# Altium schematic sheet ANSIN.SchDoc
size A3
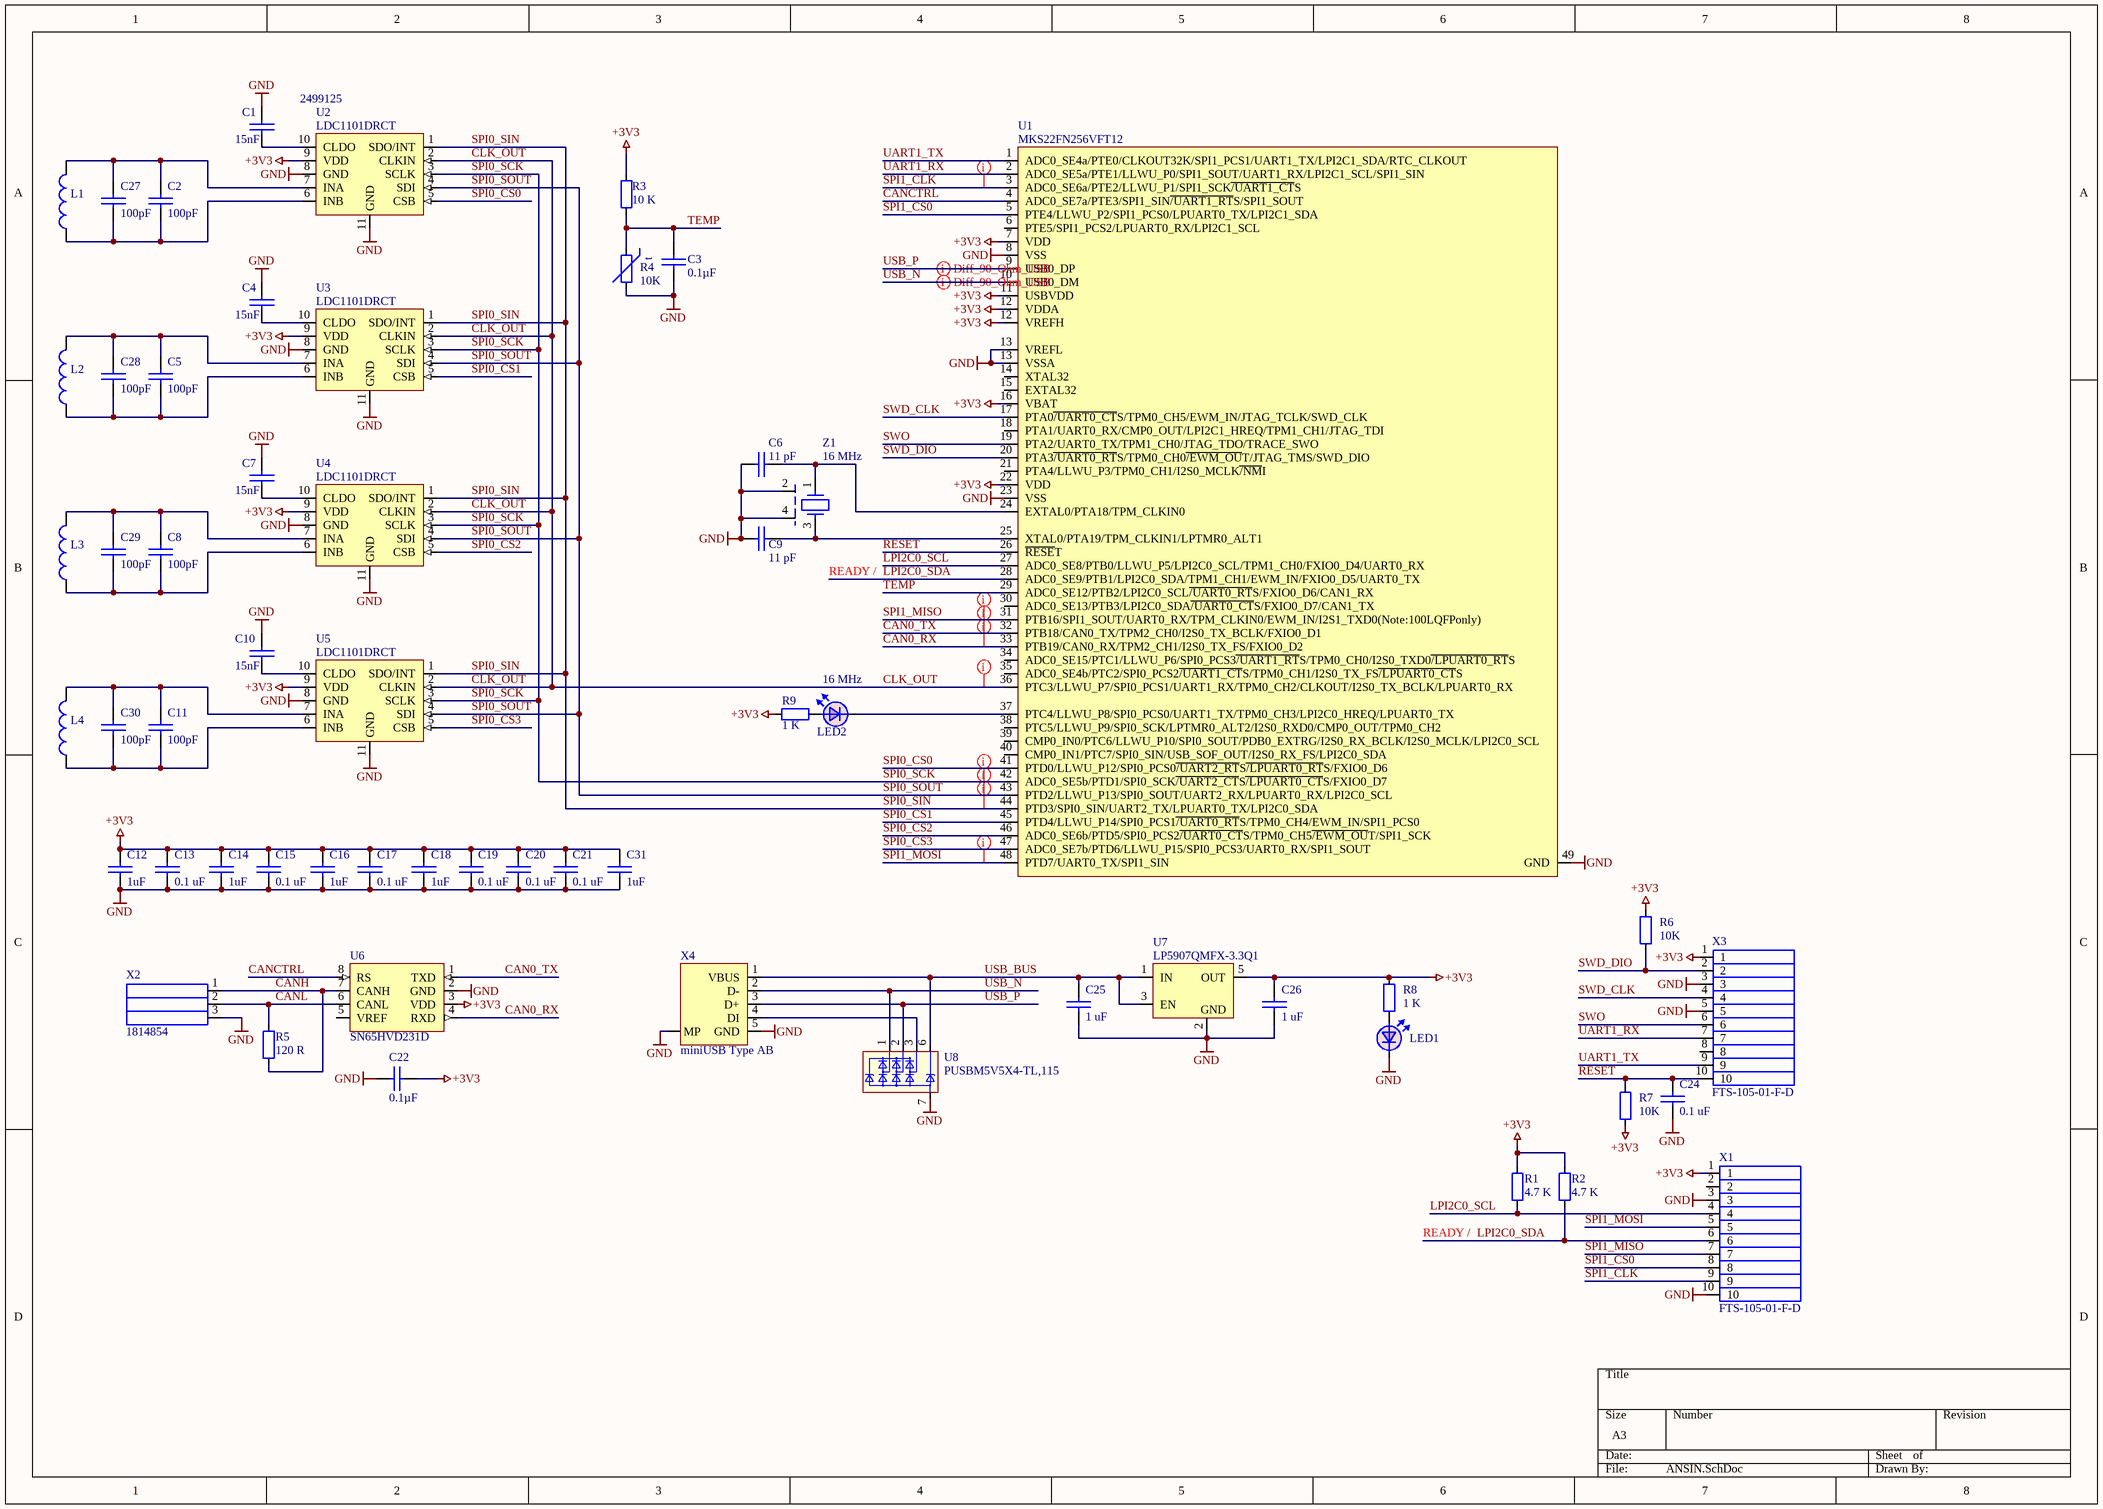
[diagram p0: ANSIN.SchDoc]

## Parts
C1  value 15nF  [1005[0402]]  (hidden comment: GRM155R71H153KA12J)
C2  value 100pF  [1005[0402]]  (hidden comment: CBR04C101F3GAC)
C3  value 0.1µF  [1608[0603]]  (hidden comment: CL10B104KA8NNND)
C4  value 15nF  [1005[0402]]  (hidden comment: GRM155R71H153KA12J)
C5  value 100pF  [1005[0402]]  (hidden comment: CBR04C101F3GAC)
C6  value 11 pF  [1005[0402]]  (hidden comment: 04023U110FAT2A)
C7  value 15nF  [1005[0402]]  (hidden comment: GRM155R71H153KA12J)
C8  value 100pF  [1005[0402]]  (hidden comment: CBR04C101F3GAC)
C9  value 11 pF  [1005[0402]]  (hidden comment: 04023U110FAT2A)
C10  value 15nF  [1005[0402]]  (hidden comment: GRM155R71H153KA12J)
C11  value 100pF  [1005[0402]]  (hidden comment: CBR04C101F3GAC)
C12  value 1uF  [1005[0402]]  (hidden comment: C1005X6S1C105K050BC)
C13  value 0.1 uF  [1005[0402]]  (hidden comment: C0402C104K8PACTU)
C14  value 1uF  [1005[0402]]  (hidden comment: C1005X6S1C105K050BC)
C15  value 0.1 uF  [1005[0402]]  (hidden comment: C0402C104K8PACTU)
C16  value 1uF  [1005[0402]]  (hidden comment: C1005X6S1C105K050BC)
C17  value 0.1 uF  [1005[0402]]  (hidden comment: C0402C104K8PACTU)
C18  value 1uF  [1005[0402]]  (hidden comment: C1005X6S1C105K050BC)
C19  value 0.1 uF  [1005[0402]]  (hidden comment: C0402C104K8PACTU)
C20  value 0.1 uF  [1005[0402]]  (hidden comment: C0402C104K8PACTU)
C21  value 0.1 uF  [1005[0402]]  (hidden comment: C0402C104K8PACTU)
C22  value 0.1µF  [1608[0603]]  (hidden comment: CL10B104KA8NNND)
C24  value 0.1 uF  [1005[0402]]  (hidden comment: C0402C104K8PACTU)
C25  value 1 uF  [1608[0603]]  (hidden comment: CL10A105KO8NNNC)
C26  value 1 uF  [1608[0603]]  (hidden comment: CL10A105KO8NNNC)
C27  value 100pF  [1005[0402]]  (hidden comment: CBR04C101F3GAC)
C28  value 100pF  [1005[0402]]  (hidden comment: CBR04C101F3GAC)
C29  value 100pF  [1005[0402]]  (hidden comment: CBR04C101F3GAC)
C30  value 100pF  [1005[0402]]  (hidden comment: CBR04C101F3GAC)
C31  value 1uF  [1005[0402]]  (hidden comment: C1005X6S1C105K050BC)
L1  Coil  [Coil_4layers_8turns]  (value not drawn)  (net tie, no BOM)
L2  Coil  [Coil_4layers_8turns]  (value not drawn)  (net tie, no BOM)
L3  Coil  [Coil_4layers_8turns]  (value not drawn)  (net tie, no BOM)
L4  Coil  [Coil_4layers_8turns]  (value not drawn)  (net tie, no BOM)
LED1  SML-211UTT86  [0805 LED]  (value not drawn)
LED2  SML-211UTT86  [0805 LED]  (value not drawn)
R1  value 4.7 K  [0603]  (hidden comment: RL0603K004.7-1)
R2  value 4.7 K  [0603]  (hidden comment: RL0603K004.7-1)
R3  value 10 K  [0603]  (hidden comment: RL0603K010-1)
R4  value 10K  [0805]  (hidden comment: NCP21XV103J03RA)
R5  value 120 R  [0603]  (hidden comment: RL0603E120-1)
R6  value 10K  [0402]  (hidden comment: MCR01MZPJ103)
R7  value 10K  [0402]  (hidden comment: MCR01MZPJ103)
R8  value 1 K  [0603]  (hidden comment: RL0603K001-1)
R9  value 1 K  [0603]  (hidden comment: RL0603K001-1)
U1  MKS22FN256VFT12  [48-pin QFN NXP]
U2  LDC1101DRCT  Supplier Part Number 1: 2499125  [TI S-PVSON-N10]
U3  LDC1101DRCT  [TI S-PVSON-N10]
U4  LDC1101DRCT  [TI S-PVSON-N10]
U5  LDC1101DRCT  [TI S-PVSON-N10]
U6  SN65HVD231D  [SO-8]
U7  LP5907QMFX-3.3Q1  [SOT23-5]
U8  PUSBM5V5X4-TL,115  [DFN1616-6]
X1  FTS-105-01-F-D  [FTS-105-01-F-D]
X2  1814854  [1814854]
X3  FTS-105-01-F-D  [FTS-105-01-F-D]
X4  miniUSB Type AB  [USB AB 56579-0576 Molex]
Z1  value 16 MHz  [4-SMD 2.00mm x 1.60mm]  (hidden comment: ABM11-16.000MHZ-9-B1U-T)

## Nets
+3V3: C12.1 C13.1 C14.1 C15.1 C16.1 C17.1 C18.1 C19.1 C20.1 C21.1 C22.1 C26.1 C31.1 R1.2 R2.2 R3.2 R6.2 R7.1 R8.2 R9.2 U1.7(VDD) U1.11(USBVDD) U1.12(VDDA) U1.16(VBAT) U1.22(VDD) U2.9(VDD) U3.9(VDD) U4.9(VDD) U5.9(VDD) U6.3(VDD) U7.5(OUT) X1.1 X3.1
GND: C1.1 C3.1 C4.1 C6.2 C7.1 C9.2 C10.1 C12.2 C13.2 C14.2 C15.2 C16.2 C17.2 C18.2 C19.2 C20.2 C21.2 C22.2 C24.2 C25.2 C26.2 C31.2 LED1.2 R4.1 U1.8(VSS) U1.13(VREFL) U1.23(VSS) U1.49(GND) U2.8(GND) U2.11(GND) U3.8(GND) U3.11(GND) U4.8(GND) U4.11(GND) U5.8(GND) U5.11(GND) U6.2(GND) U7.2(GND) U8.7 X1.3 X1.10 X2.3 X3.3 X3.5 X4.5(GND) X4.MP Z1.2 Z1.4
CAN0_RX: U1.33(PTB19/CAN0_RX/TPM2_CH1/I2S0_TX_FS/FXIO0_D2) U6.4(RXD)
CAN0_TX: U1.32(PTB18/CAN0_TX/TPM2_CH0/I2S0_TX_BCLK/FXIO0_D1) U6.1(TXD)
CANCTRL: U1.4(ADC0_SE7a/PTE3/SPI1_SIN~{/UART1_RT}S/SPI1_SOUT) U6.8(RS)
CANH: R5.1 U6.7(CANH) X2.1
CANL: R5.2 U6.6(CANL) X2.2
CLK_OUT: U1.36(PTC3/LLWU_P7/SPI0_PCS1/UART1_RX/TPM0_CH2/CLKOUT/I2S0_TX_BCLK/LPUART0_RX) U2.2(CLKIN) U3.2(CLKIN) U4.2(CLKIN) U5.2(CLKIN)
LPI2C0_SCL: R1.1 U1.27(ADC0_SE8/PTB0/LLWU_P5/LPI2C0_SCL/TPM1_CH0/FXIO0_D4/UART0_RX) X1.4
LPI2C0_SDA: R2.1 U1.28(ADC0_SE9/PTB1/LPI2C0_SDA/TPM1_CH1/EWM_IN/FXIO0_D5/UART0_TX) X1.6
RESET: C24.1 R7.2 U1.26(~{RESE}T) X3.10
SPI0_CS0: U1.41(PTD0/LLWU_P12/SPI0_PCS0~{/UART2_RT}S~{/LPUART0_RT}S/FXIO0_D6) U2.5(CSB)
SPI0_CS1: U1.45(PTD4/LLWU_P14/SPI0_PCS1~{/UART0_RT}S/TPM0_CH4/EWM_IN/SPI1_PCS0) U3.5(CSB)
SPI0_CS2: U1.46(ADC0_SE6b/PTD5/SPI0_PCS2~{/UART0_CT}S/TPM0_CH5~{/EWM_OU}T/SPI1_SCK) U4.5(CSB)
SPI0_CS3: U1.47(ADC0_SE7b/PTD6/LLWU_P15/SPI0_PCS3/UART0_RX/SPI1_SOUT) U5.5(CSB)
SPI0_SCK: U1.42(ADC0_SE5b/PTD1/SPI0_SCK~{/UART2_CT}S~{/LPUART0_CT}S/FXIO0_D7) U2.3(SCLK) U3.3(SCLK) U4.3(SCLK) U5.3(SCLK)
SPI0_SIN: U1.44(PTD3/SPI0_SIN/UART2_TX/LPUART0_TX/LPI2C0_SDA) U2.1(SDO/INT) U3.1(SDO/INT) U4.1(SDO/INT) U5.1(SDO/INT)
SPI0_SOUT: U1.43(PTD2/LLWU_P13/SPI0_SOUT/UART2_RX/LPUART0_RX/LPI2C0_SCL) U2.4(SDI) U3.4(SDI) U4.4(SDI) U5.4(SDI)
SPI1_CLK: U1.3(ADC0_SE6a/PTE2/LLWU_P1/SPI1_SCK~{/UART1_CT}S) X1.9
SPI1_CS0: U1.5(PTE4/LLWU_P2/SPI1_PCS0/LPUART0_TX/LPI2C1_SDA) X1.8
SPI1_MISO: U1.31(PTB16/SPI1_SOUT/UART0_RX/TPM_CLKIN0/EWM_IN/I2S1_TXD0(Note:100LQFPonly)) X1.7
SPI1_MOSI: U1.48(PTD7/UART0_TX/SPI1_SIN) X1.5
SWD_CLK: U1.17(PTA0~{/UART0_CT}S/TPM0_CH5/EWM_IN/JTAG_TCLK/SWD_CLK) X3.4
SWD_DIO: R6.1 U1.20(PTA3~{/UART0_RT}S/TPM0_CH0~{/EWM_OU}T/JTAG_TMS/SWD_DIO) X3.2
SWO: U1.19(PTA2/UART0_TX/TPM1_CH0/JTAG_TDO/TRACE_SWO) X3.6
TEMP: C3.2 R3.1 R4.2 U1.29(ADC0_SE12/PTB2/LPI2C0_SCL~{/UART0_RT}S/FXIO0_D6/CAN1_RX)
UART1_RX: U1.2(ADC0_SE5a/PTE1/LLWU_P0/SPI1_SOUT/UART1_RX/LPI2C1_SCL/SPI1_SIN) X3.7
UART1_TX: U1.1(ADC0_SE4a/PTE0/CLKOUT32K/SPI1_PCS1/UART1_TX/LPI2C1_SDA/RTC_CLKOUT) X3.9
USB_BUS: C25.1 U7.1(IN) U7.3(EN) U8.6 X4.1(VBUS)
USB_N: U1.10(USB0_DM) U8.1 X4.2(D-)
USB_P: U1.9(USB0_DP) U8.2 X4.3(D+)
NetC1_2: C1.2 U2.10(CLDO)
NetC2_1: C2.1 C27.1 L1.2 U2.7(INA)
NetC2_2: C2.2 C27.2 L1.1 U2.6(INB)
NetC4_2: C4.2 U3.10(CLDO)
NetC5_1: C5.1 C28.1 L2.2 U3.7(INA)
NetC5_2: C5.2 C28.2 L2.1 U3.6(INB)
NetC6_1: C6.1 U1.24(EXTAL0/PTA18/TPM_CLKIN0) Z1.1
NetC7_2: C7.2 U4.10(CLDO)
NetC8_1: C8.1 C29.1 L3.2 U4.7(INA)
NetC8_2: C8.2 C29.2 L3.1 U4.6(INB)
NetC9_1: C9.1 U1.25(XTAL0/PTA19/TPM_CLKIN1/LPTMR0_ALT1) Z1.3
NetC10_2: C10.2 U5.10(CLDO)
NetC11_1: C11.1 C30.1 L4.2 U5.7(INA)
NetC11_2: C11.2 C30.2 L4.1 U5.6(INB)
NetLED1_1: LED1.1 R8.1
NetLED2_1: LED2.1 R9.1
NetLED2_2: LED2.2 U1.37(PTC4/LLWU_P8/SPI0_PCS0/UART1_TX/TPM0_CH3/LPI2C0_HREQ/LPUART0_TX)
NetU8_3: U8.3 X4.4(DI)

Not connected (* = marked no-connect by the designer): U1 6(PTE5/SPI1_PCS2/LPUART0_RX/LPI2C1_SCL) 14(XTAL32) 15(EXTAL32) 18(PTA1/UART0_RX/CMP0_OUT/LPI2C1_HREQ/TPM1_CH1/JTAG_TDI) 21(PTA4/LLWU_P3/TPM0_CH1/I2S0_MCLK~{/NM}I) 30(ADC0_SE13/PTB3/LPI2C0_SDA~{/UART0_CT}S/FXIO0_D7/CAN1_TX) 34(ADC0_SE15/PTC1/LLWU_P6/SPI0_PCS3~{/UART1_RT}S/TPM0_CH0/I2S0_TXD0~{/LPUART0_RT}S) 35(ADC0_SE4b/PTC2/SPI0_PCS2~{/UART1_CT}S/TPM0_CH1/I2S0_TX_FS~{/LPUART0_CT}S) 38(PTC5/LLWU_P9/SPI0_SCK/LPTMR0_ALT2/I2S0_RXD0/CMP0_OUT/TPM0_CH2) 39(CMP0_IN0/PTC6/LLWU_P10/SPI0_SOUT/PDB0_EXTRG/I2S0_RX_BCLK/I2S0_MCLK/LPI2C0_SCL) 40(CMP0_IN1/PTC7/SPI0_SIN/USB_SOF_OUT/I2S0_RX_FS/LPI2C0_SDA); U6 5(VREF); X1 2; X3 8

## Layout directives
differential pair: USB_N, USB_P
net class SPI_Bus: SPI0_SCK, SPI0_SIN, SPI0_SOUT, SPI1_CLK, SPI1_MISO, SPI1_MOSI
net class CLK_OUT: CLK_OUT
net class CAN_Bus: CAN0_RX, CAN0_TX

## Notes on the sheet
- READY /
- 16 MHz
- (in symbol NCP21XV103J03RA) t

## Library data of the parts
C1 C4 C7 C10 = GRM155R71H153KA12J: 15 nF ±10%, 50V, X7R 0402, -55°C ~ 125°C; Manufacturer: Murata Electronics North America; PartNum: 490-6355-1-ND; Tolerance: ±10%; Distributor: Digi-Key; Price: 0.1$; PartName: GRM155R71H153KA12J; Voltage: 50V
  C1: Supplier 1: Farnell; Supplier Part Number 1: 1865462
C2 C5 C8 C11 C27-C30 = CBR04C101F3GAC: 100pF ±1% 25V,High Q, C0G, NP0 0402; Manufacturer: Kemet; PartNum: 2676257; Tolerance: ±1%; Distributor: Farnell; Price: 0.39$; PartName: CBR04C101F3GAC; Voltage: 25V
  C27: Supplier 1: Farnell; Supplier Part Number 1: 2676257
C3 C22 = CVNF100K0603-25: 0.1 uF, 50V, 10% , X7R,  0603 SMD MLC Capacitor; Manufacturer: WALSIN; PartNum: 2496834; PartName: 0603B104K500CT; Tolerance: ± 10%; Distributor: Farnell; Price: 0.0026 Euro
C6 C9 = 04023U110FAT2A: 11 pF, 25V, +-1%, NP0/COG, 0402, -55..+125; Manufacturer: AVX Corporation; PartNum: 04023U110FAT2A-ND; Tolerance: +-1%; Distributor: Digi-Key; PartName: 04023U110FAT2A
C12 C14 C16 C18 C31 = C1005X6S1C105K050BC: 1 µF ±10% 16V, Low ESL X6S, 0402; Manufacturer: TDK Corporation; PartNum: 445-9086-1-ND; Tolerance: ±10%; Distributor: Digi-Key; Price: 0.13$; PartName: C1005X6S1C105K050BC; Voltage: 16V
C13 C15 C17 C19-C21 C24 = C0402C104K8PACTU: 0.1 uF, 10V, 10% , X5R,  0402, -55°C ~ 85°C; Manufacturer: Kemet; PartNum: 399-3027-1-ND; Tolerance: +-10%; Distributor: DigiKey; PartName: C0402C104K8PACTU
C25 C26 = CL10A105KO8NNNC: 1.0 uF, 16V, 10%, X5R, 0603, -55..85 С; Manufacturer: Samsung; PartNum: 1276-1034-1-ND; Tolerance: 10%; Distributor: Digi-Key; PartName: CL10A105KO8NNNC
L1-L4 = Coil_4layers_8turns
LED1 LED2 = SML-211UTT86: 0805 red LED, hibright, 2 mA, 1.8V, 130°; Manufacturer: Rohm; PartNum: 511-1292-1-ND; Distributor: Digi-Key; Price: 0.34$; Value: Red; PartName: SML-211UTT86
R1 R2 = RL0603K004.7-1: 4.7 K, 1%, 0603, SMD Resistor, Taped; Manufacturer: Vishay; Voltage: 75 V; Distributor: Schukat; Price: 0.002 Euro; Tolerance: 1%; PartNum: RL0603K004.7-1; PartName: RL0603K004.7-1
R3 = RL0603K010-1: 10 K, 1%, 0603, SMD Resistor, Taped; Manufacturer: Vishay Dale; PartNum: 541-10KGCT-ND; PartName: CRCW060310K0JNEA; Voltage: 75 V; Distributor: Digi-Key; Price: 0.016$; Tolerance: 1%
R4 = NCP21XV103J03RA: Thermistor 10k, 0805, NTC; Manufacturer: Murata; PartNum: 490-2456-1-ND; Distributor: Digi-Key; Price: 0.31$; PartName: NCP21XV103J03RA
R5 = RL0603E120-1: 120 R, 1%, 0603, SMD Resistor, Taped; Manufacturer: Vishay; Voltage: 75 V; Distributor: Schukat; Price: 0.002 Euro; Tolerance: 1%; PartNum: RL0603E120-1; PartName: RL0603E120-1
R6 R7 = MCR01MZPJ103: 10 K, 0402, Thick Film, -55..+155; Manufacturer: Rohm Semiconductor; PartNum: RHM10KJTR-ND; Tolerance: 5%; Distributor: Digi-Key; Price: 0.1$; PartName: MCR01MZPJ103
R8 R9 = RL0603K001-1: 1 K, 1%, 0603, SMD Resistor, Taped; Manufacturer: Vishay; Voltage: 75 V; Distributor: Schukat; Price: 0.002 Euro; Tolerance: 1%; PartNum: RL0603K001-1; PartName: RL0603K001-1
U1 = MKS22FN256VFT12: ARM® Cortex®-M4 Kinetis KS22 Microcontroller IC 32-Bit 120MHz 256KB (256K x 8) FLASH 48-QFN (7x7); Manufacturer: NXP USA Inc.; PartNum: MKS22FN256VFT12-ND; Distributor: Digi-Key; PartName: MKS22FN256VFT12
U2-U5 = LDC1101DRCT: Inductance-to-Digital Converter 16 b, 24 bit 150k, 180k SPI, -40°C ~ 125°C,  10-VSON (3x3); Manufacturer: Texas Instruments; PartNum: 296-42280-1-ND; Price: 5.71 Eur; Distributor: Digi-Key; PartName: LDC1101DRCT
  U2: Supplier 1: Farnell
U6 = SN65HVD231D: 3.3-V CAN TRANSCEIVERS SO-8; Manufacturer: Texas Instruments; PartNum: 296-12206-5-ND; Price: 4.2$; Distributor: Digi-Key; PartName: SN65HVD231D
U7 = LP5907QMFX-3.3Q1: LDO 3.3 V, 250 mA, Vin < 5.5V, Iq < 12uA, -40..+125 C, SOT23-5; Manufacturer: Texas Instruments; PartNum: 296-40365-1-ND; Distributor: Digi-Key; PartName: LP5907QMFX-3.3Q1; Supplier 1: Digi-Key; Supplier Part Number 1: 296-40365-1-ND
U8 = PUSBM5V5X4-TL,115: TVS DIODE 5.5VWM 12VC 6HXSON; Manufacturer: NXP Semiconductors; PartNum: 568-10921-1-ND; Distributor: Digi-Key; PartName: PUSBM5V5X4-TL,115
X1 X3 = FTS-105-01-F-D: Board-To-Board Connector, Vertical, FTS Series, Through Hole, Header, 10, 1.27 mm; Manufacturer: SAMTEC; PartNum: 1928242; Distributor: Farnell; PartName: FTS-105-01-F-D
X2 = 1814854: SSL Connector 3 Position Header, Male Pins Board to Cable/Wire 0.098" (2.50mm) Solder; Manufacturer: Phoenix Contact; PartNum: 277-9957-1-ND; Distributor: Digi-Key; PartName: 1814854
X4 = USB AB 56579-0576: SMD USB - OTG, miniUSB Type AB; Manufacturer: Molex/Waldom Electronics Corp; PartNum: WM17122CT-ND; PartName: 0565790576; Distributor: Digi-Key; Price: 1.71$; Supplier 1: Farnell; Supplier Part Number 1: 9786490
Z1 = ABM11-16.000MHZ-9-B1U-T: 16 MHz, 9 pF, ±10ppm, 2.00mm x 1.60mm, -20°C ~ 70°C; Manufacturer: Abracon LLC; PartNum: 535-13598-1-ND; Price: 0.98 $; Distributor: Digi-Key; Tolerance: 10 ppm; PartName: ABM11-16.000MHZ-9-B1U-T; Supplier 1: Digi-Key; Supplier Part Number 1: 535-13598-1-ND